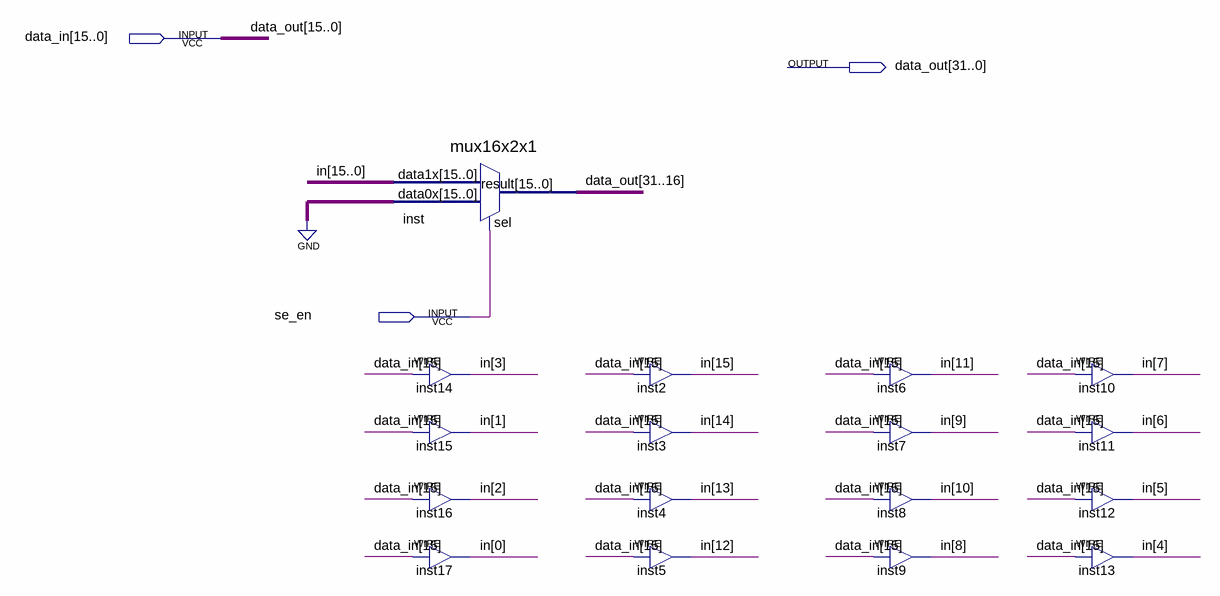
[diagram p0: schematic sheet]
// Quartus schematic sign_extend.bdf as structural Verilog: 17 symbols, 3 pins
module sign_extend (
  input  [15:0] data_in,
  input  se_en,
  output [31:0] data_out
);

  wire [15:0] in;

  mux16x2x1 inst (.data1x(in), .data0x({16{1'b0}}), .sel(se_en), .result(data_out[31:16]));
  assign in[3] = data_in[15];  // WIRE inst14
  assign in[1] = data_in[15];  // WIRE inst15
  assign in[2] = data_in[15];  // WIRE inst16
  assign in[0] = data_in[15];  // WIRE inst17
  assign in[15] = data_in[15];  // WIRE inst2
  assign in[14] = data_in[15];  // WIRE inst3
  assign in[13] = data_in[15];  // WIRE inst4
  assign in[12] = data_in[15];  // WIRE inst5
  assign in[11] = data_in[15];  // WIRE inst6
  assign in[9] = data_in[15];  // WIRE inst7
  assign in[10] = data_in[15];  // WIRE inst8
  assign in[8] = data_in[15];  // WIRE inst9
  assign in[7] = data_in[15];  // WIRE inst10
  assign in[6] = data_in[15];  // WIRE inst11
  assign in[5] = data_in[15];  // WIRE inst12
  assign in[4] = data_in[15];  // WIRE inst13

  assign data_out[15:0] = data_in;
endmodule
